# Altium project Quadcopter_v1.0.PrjPCB
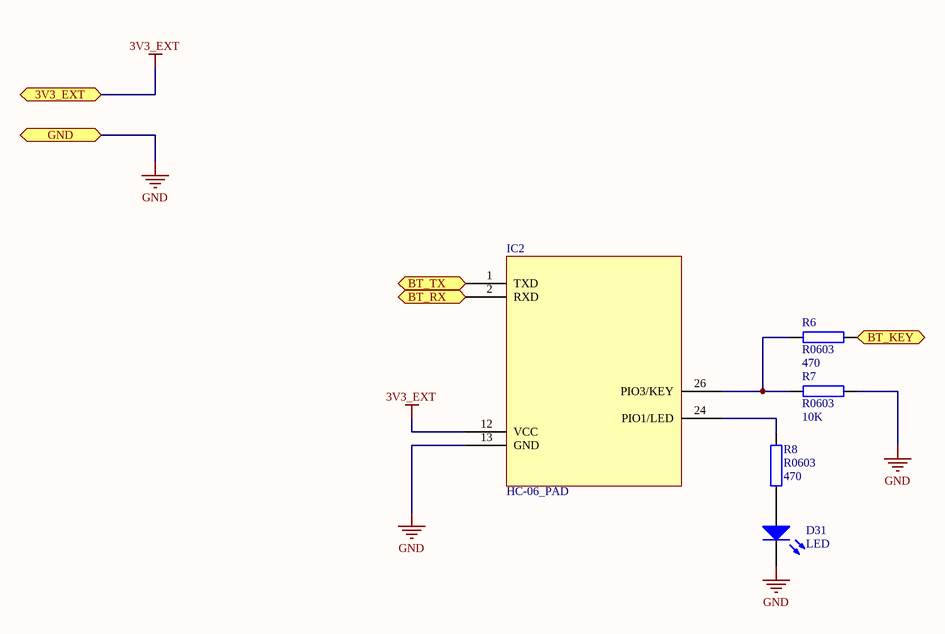
[diagram p0: BlueTooth.SchDoc]
8 sheets, 110 parts. Net scope: flat (ports and power ports of the same name join across sheets).
Board file: Quadcopter_v1.0.PcbDoc
Sheets:
  BlueTooth.SchDoc
  Quadcopter_v1.0.SchDoc
  WiFi.SchDoc
  Power.SchDoc
  MPU.SchDoc
  Motor.SchDoc
  nRF24L01.SchDoc
  STM32F103CBT6.SchDoc

## Sheet BlueTooth.SchDoc
size A

### Parts
(Parts that share a designator on the sheet are numbered #1, #2 ... from top to bottom, then left to right.)
D31  LED  [LED_0603]
IC2  HC-06_PAD  [HC-0X_PAD]
R6#1  R0603  value 470  [R0603]
R7#1  R0603  value 10K  [R0603]
R8#1  R0603  value 470  [R0603]

### Ports
3V3_EXT, BT_KEY (in), BT_RX (in), BT_TX (out), GND

### Nets
3V3_EXT: IC2.12(VCC) ; port 3V3_EXT
GND: D31.2(K) IC2.13(GND) R7#1.2 ; port GND
NetD31_1: D31.1(A) R8#1.1
NetIC2_1: IC2.1(TXD) ; port BT_TX
NetIC2_2: IC2.2(RXD) ; port BT_RX
NetIC2_24: IC2.24(PIO1/LED) R8#1.2
NetIC2_26: IC2.26(PIO3/KEY) R6#1.1 R7#1.1
NetR6#1_2: R6#1.2 ; port BT_KEY

### Library data of the parts
D31 = LED: Typical INFRARED GaAs LED; Published: 8-Jun-2000; LatestRevisionDate: 08-Jul-2005; LatestRevisionNote: Mech Layer 1 removed.; PackageReference: LED-0; Publisher: Altium Limited; PackageDescription: LED; 2 Leads
R6#1 R7#1 R8#1 = Res3: Resistor; Published: 8-Jun-2000; LatestRevisionDate: 29-May-2009; LatestRevisionNote: IPC-7351 Footprint Added.; PackageReference: R0603; Publisher: Altium Limited; PackageDescription: Chip Resistor

## Sheet Quadcopter_v1.0.SchDoc
size A3; PageSetup: Record=PageOptions|CenterHorizontal=True|CenterVertical=True|PrintScale=1.00|XCorrection=1.00|YCorrection=1.00|PrintKind=1|BorderSize=5000000|LeftOffset=0|BottomOffset=0|Orientation=2|PaperLength=1000|PaperWidth=1000|Scale=100|PaperSource=7|PrintQuality=-3|MediaType=1|DitherType=10|PrintScaleMode=1|PaperKind=A3|PaperIndex=8
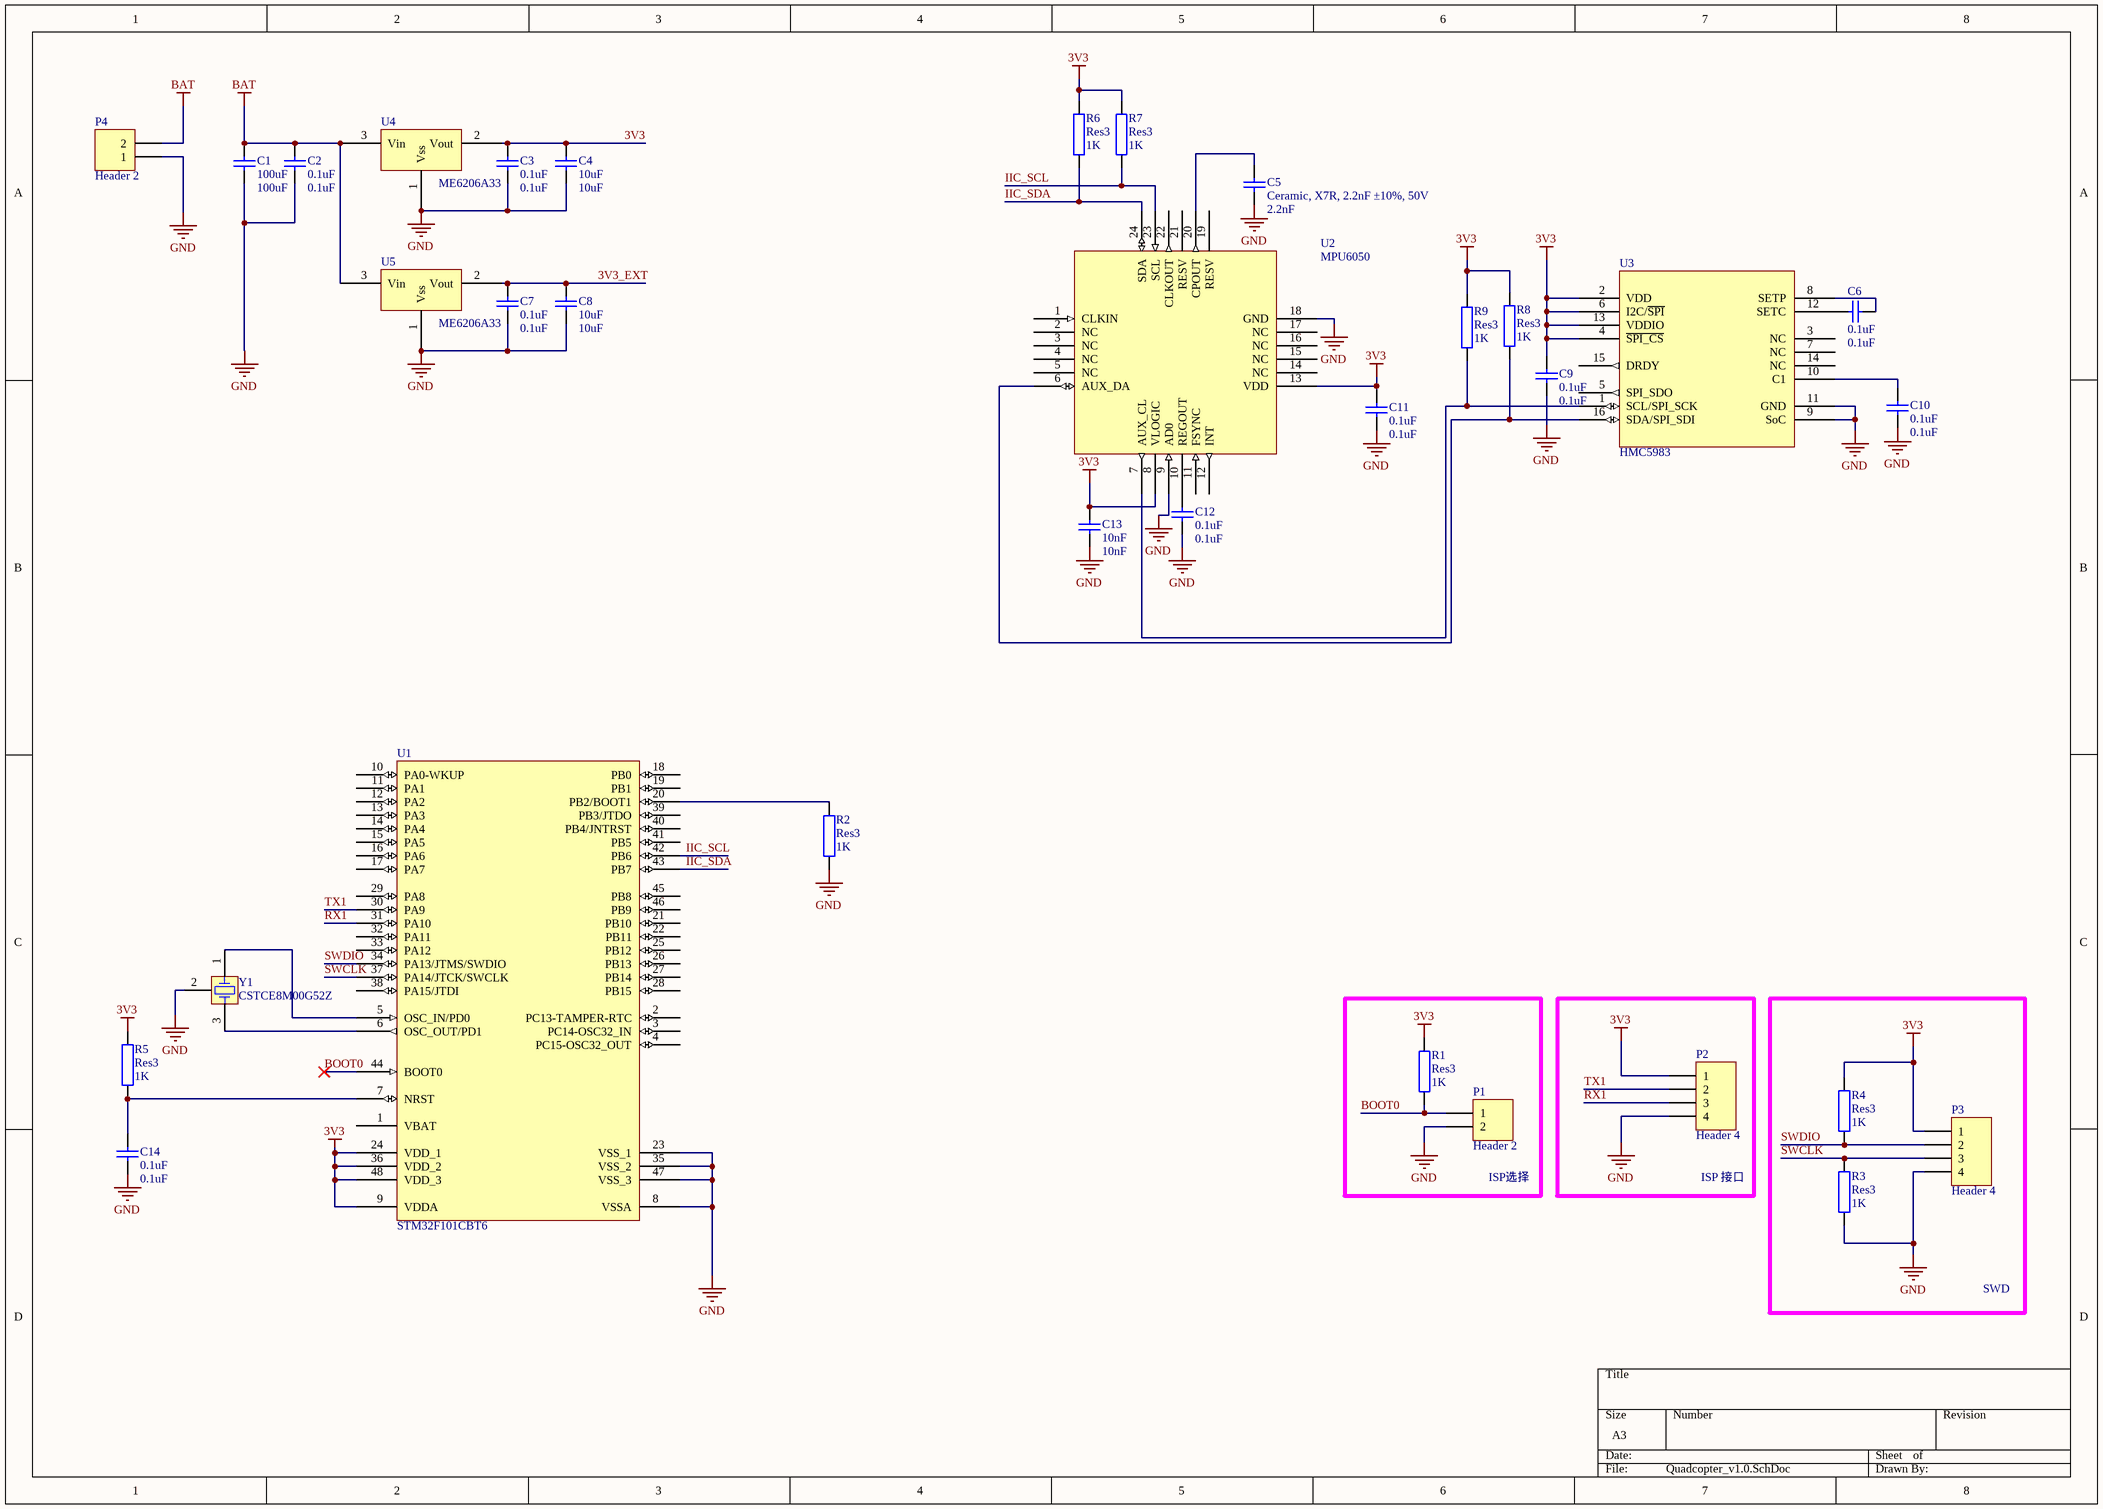
[diagram p1: Quadcopter_v1.0.SchDoc]

### Parts
(Parts that share a designator on the sheet are numbered #1, #2 ... from top to bottom, then left to right.)
C1#1  100uF  [c0805]
C2#1  0.1uF  [c0805]
C3#1  0.1uF  [c0805]
C4#1  10uF  [c0805]
C5#1  Ceramic, X7R, 2.2nF ±10%, 50V  value 2.2nF  [c0805]
C6#1  0.1uF  [c0805]
C7#1  0.1uF  [c0805]
C8#1  10uF  [c0805]
C9#1  0.1uF  [C1206]
C10#1  0.1uF  [C1206]
C11#1  0.1uF  [c0805]
C12#1  0.1uF  [c0805]
C13#1  10nF  [c0805]
C14#1  0.1uF  [C1206]
P1#1  Header 2  [HDR1X2]
P2#1  Header 4  [HDR1X4]
P3#1  Header 4  [HDR1X4]
P4  Header 2  [HDR1X2]
R1#1  Res3  value 1K  [r0603]
R2#1  Res3  value 1K  [r0603]
R3#1  Res3  value 1K  [r0603]
R4#1  Res3  value 1K  [r0603]
R5#1  Res3  value 1K  [r0603]
R6#2  Res3  value 1K  [r0603]
R7#2  Res3  value 1K  [r0603]
R8#2  Res3  value 1K  [r0603]
R9#1  Res3  value 1K  [r0603]
U1#1  STM32F101CBT6  [LQFP48_N]
U2#1  MPU6050  [24 Lead QFN]
U3#1  HMC5983  [16 Lead QFN 2]
U4#1  ME6206A33  [SOT 23]
U5#1  ME6206A33  [SOT 23]
Y1#1  CSTCE8M00G52Z  [X8MCSTCR]

### Blocks framed on the sheet
ISP选择: P1#1 R1#1
ISP 接口: P2#1
SWD: P3#1 R3#1 R4#1

### Nets
3V3: C3#1.2 C4#1.2 C9#1.2 C11#1.2 C13#1.2 P2#1.1 P3#1.1 R1#1.2 R4#1.2 R5#1.1 R6#2.2 R7#2.2 R8#2.2 R9#1.2 U1#1.9(VDDA) U1#1.24(VDD_1) U1#1.36(VDD_2) U1#1.48(VDD_3) U2#1.8(VLOGIC) U2#1.13(VDD) U3#1.2(VDD) U3#1.4(~{SPI_CS}) U3#1.6(I2C/~{SPI}) U3#1.13(VDDIO) U4#1.2(Vout)
BAT: C1#1.2 C2#1.2 P4.2 U4#1.3(Vin) U5#1.3(Vin)
GND: C1#1.1 C2#1.1 C3#1.1 C4#1.1 C5#1.1 C7#1.1 C8#1.1 C9#1.1 C10#1.1 C11#1.1 C12#1.1 C13#1.1 C14#1.1 P1#1.2 P2#1.4 P3#1.4 P4.1 R2#1.1 R3#1.1 U1#1.8(VSSA) U1#1.23(VSS_1) U1#1.35(VSS_2) U1#1.47(VSS_3) U2#1.9(AD0) U2#1.18(GND) U3#1.9(SoC) U3#1.11(GND) U4#1.1(Vss) U5#1.1(Vss) Y1#1.2(COM)
3V3_EXT: C7#1.2 C8#1.2 U5#1.2(Vout)
BOOT0: P1#1.1 R1#1.1 U1#1.44(BOOT0)
IIC_SCL: R7#2.1 U1#1.42(PB6) U2#1.23(SCL)
IIC_SDA: R6#2.1 U1#1.43(PB7) U2#1.24(SDA)
RX1: P2#1.3 U1#1.31(PA10)
SWCLK: P3#1.3 R3#1.2 U1#1.37(PA14/JTCK/SWCLK)
SWDIO: P3#1.2 R4#1.1 U1#1.34(PA13/JTMS/SWDIO)
TX1: P2#1.2 U1#1.30(PA9)
NetC5#1_2: C5#1.2 U2#1.20(CPOUT)
NetC6#1_1: C6#1.1 U3#1.8(SETP)
NetC6#1_2: C6#1.2 U3#1.12(SETC)
NetC10#1_2: C10#1.2 U3#1.10(C1)
NetC12#1_2: C12#1.2 U2#1.10(REGOUT)
NetC14#1_2: C14#1.2 R5#1.2 U1#1.7(NRST)
NetR2#1_2: R2#1.2 U1#1.20(PB2/BOOT1)
NetR8#2_1: R8#2.1 U2#1.6(AUX_DA) U3#1.16(SDA/SPI_SDI)
NetR9#1_1: R9#1.1 U2#1.7(AUX_CL) U3#1.1(SCL/SPI_SCK)
NetU1#1_5: U1#1.5(OSC_IN/PD0) Y1#1.1(OSC1)
NetU1#1_6: U1#1.6(OSC_OUT/PD1) Y1#1.3(OSC2)

Not connected (* = marked no-connect by the designer): U1#1 1(VBAT) 2(PC13-TAMPER-RTC) 3(PC14-OSC32_IN) 4(PC15-OSC32_OUT) 10(PA0-WKUP) 11(PA1) 12(PA2) 13(PA3) 14(PA4) 15(PA5) 16(PA6) 17(PA7) 18(PB0) 19(PB1) 21(PB10) 22(PB11) 25(PB12) 26(PB13) 27(PB14) 28(PB15) 29(PA8) 32(PA11) 33(PA12) 38(PA15/JTDI) 39(PB3/JTDO) 40(PB4/JNTRST) 41(PB5) 45(PB8) 46(PB9); U2#1 1(CLKIN) 2(NC) 3(NC) 4(NC) 5(NC) 11(FSYNC) 12(INT) 14(NC) 15(NC) 16(NC) 17(NC) 19(RESV) 21(RESV) 22(CLKOUT); U3#1 3(NC) 5(SPI_SDO) 7(NC) 14(NC) 15(DRDY)

### Library data of the parts
C1#1 C2#1 C3#1 C4#1 C5#1 C7#1 C8#1 C11#1 C12#1 C13#1 = Cap Semi: Capacitor (Semiconductor SIM Model); Published: 8-Jun-2000; LatestRevisionDate: 29-May-2009; LatestRevisionNote: IPC-7351 Footprint Added.; PackageReference: C1206; Publisher: Altium Limited; PackageDescription: Chip Capacitor
  C1#1: Value: 100uF
  C2#1 C3#1 C7#1 C11#1 C12#1: Value: 0.1uF
  C4#1 C8#1: Value: 10uF
  C13#1: Value: 10nF
C6#1 C9#1 C10#1 C14#1 = Cap: Capacitor (Semiconductor SIM Model); Published: 8-Jun-2000; LatestRevisionDate: 29-May-2009; LatestRevisionNote: IPC-7351 Footprint Added.; PackageReference: C1206; Publisher: Altium Limited; PackageDescription: Chip Capacitor; Value: 0.1uF
P1#1 P4 = Header 2: Header, 2-Pin; LatestRevisionDate: 17-Jul-2002; LatestRevisionNote: Re-released for DXP Platform.; Publisher: Altium Limited
P2#1 P3#1 = Header 4: Header, 4-Pin; LatestRevisionDate: 17-Jul-2002; LatestRevisionNote: Re-released for DXP Platform.; Publisher: Altium Limited
R1#1 R2#1 R3#1 R4#1 R5#1 R6#2 R7#2 R8#2 R9#1 = Res3: Resistor; Published: 8-Jun-2000; LatestRevisionDate: 29-May-2009; LatestRevisionNote: IPC-7351 Footprint Added.; PackageReference: J1-0603; Publisher: Altium Limited; PackageDescription: Chip Resistor
U1#1 = STM32F101CBT6: STM32 ARM-based 32-bit MCU with 128 Kbytes Flash, 48-pin LQFP, Industrial Temperature; Published: 30-May-2008; DatasheetVersion: rev6, Mar-2008; PackageVersion: Mar-2008; PackageReference: LQFP48; Publisher: Altium Limited; PackageDescription: 48-Pin Low-Profile Quad Flat Pack, 7 x 7 mm Body, 0.5 mm Pitch (LQFP48); ComponentLink1Description: Manufacturer Link; ComponentLink1URL: www.st.com/stm32; ComponentLink2Description: Datasheet; ComponentLink2URL: http://www.st.com/stonline/products/literature/ds/13586.pdf
U2#1 = MPU6050: MPU6050, 24pin
U3#1 = HMC5983: HMC5983, 16pin
U4#1 U5#1 = ME6206: ME6206A33, SOT23
Y1#1 = CSTCE8M00G52Z: Crystal Oscillator, 3rd In-Line Lead Version

## Sheet WiFi.SchDoc
size A; PageSetup: Record=PageOptions|CenterHorizontal=True|CenterVertical=True|PrintScale=1.00|XCorrection=1.00|YCorrection=1.00|PrintKind=1|BorderSize=5000000|LeftOffset=0|BottomOffset=0|Orientation=2|PaperLength=1000|PaperWidth=1000|Scale=100|PaperSource=7|PrintQuality=-3|MediaType=1|DitherType=10|PrintScaleMode=1|PaperKind=Letter|PaperIndex=1
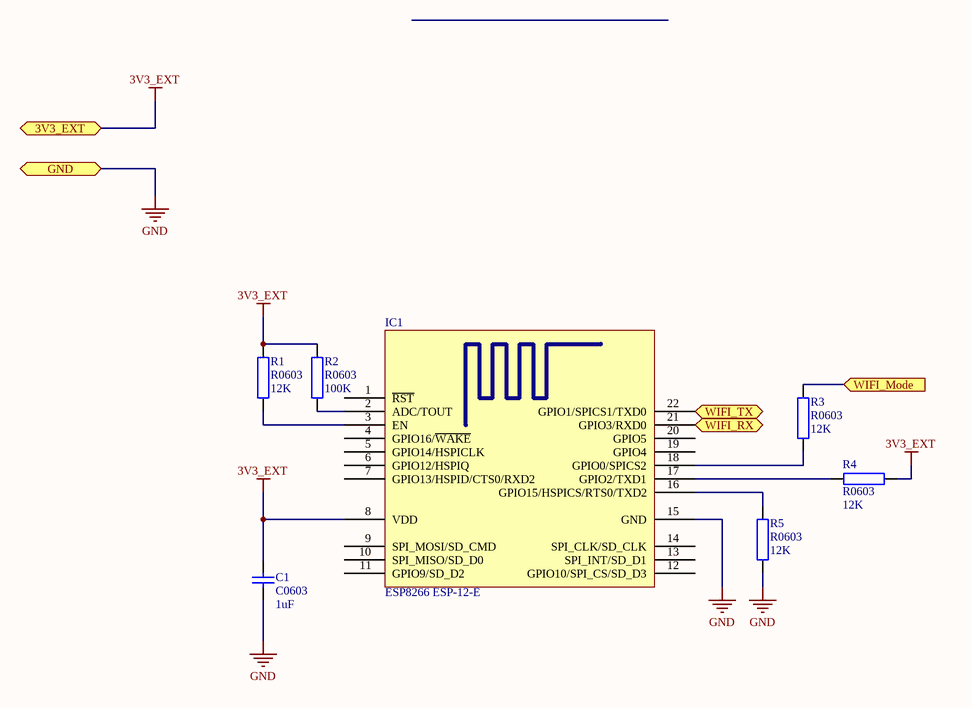
[diagram p2: WiFi.SchDoc]

### Parts
(Parts that share a designator on the sheet are numbered #1, #2 ... from top to bottom, then left to right.)
C1#2  C0603  value 1uF  [C0603]  (no BOM)
IC1  ESP8266 ESP-12-E  [ESP_12_E]
R1#2  R0603  value 12K  [R0603]
R2#2  R0603  value 100K  [R0603]
R3#2  R0603  value 12K  [R0603]
R4#2  R0603  value 12K  [R0603]
R5#2  R0603  value 12K  [R0603]

### Ports
3V3_EXT, GND, WIFI_Mode (in), WIFI_RX (in), WIFI_TX (out)

### Nets
3V3_EXT: C1#2.2 IC1.8(VDD) R1#2.2 R2#2.2 R4#2.1 ; port 3V3_EXT
GND: C1#2.1 IC1.15(GND) R5#2.2 ; port GND
NetIC1_2: IC1.2(ADC/TOUT) R2#2.1
NetIC1_3: IC1.3(EN) R1#2.1
NetIC1_16: IC1.16(GPIO15/HSPICS/RTS0/TXD2) R5#2.1
NetIC1_17: IC1.17(GPIO2/TXD1) R4#2.2
NetIC1_18: IC1.18(GPIO0/SPICS2) R3#2.2
NetIC1_21: IC1.21(GPIO3/RXD0) ; port WIFI_RX
NetIC1_22: IC1.22(GPIO1/SPICS1/TXD0) ; port WIFI_TX
NetR3#2_1: R3#2.1 ; port WIFI_Mode

Not connected (* = marked no-connect by the designer): IC1 1(~{RST}) 4(GPIO16/~{WAKE}) 5(GPIO14/HSPICLK) 6(GPIO12/HSPIQ) 7(GPIO13/HSPID/CTS0/RXD2) 9(SPI_MOSI/SD_CMD) 10(SPI_MISO/SD_D0) 11(GPIO9/SD_D2) 12(GPIO10/SPI_CS/SD_D3) 13(SPI_INT/SD_D1) 14(SPI_CLK/SD_CLK) 19(GPIO4) 20(GPIO5)

### Library data of the parts
C1#2 = Cap: Capacitor (Semiconductor SIM Model); Published: 8-Jun-2000; LatestRevisionDate: 29-May-2009; LatestRevisionNote: IPC-7351 Footprint Added.; PackageReference: C0603; Publisher: Altium Limited; PackageDescription: Chip Capacitor
R1#2 R2#2 R3#2 R4#2 R5#2 = Res3: Resistor; Published: 8-Jun-2000; LatestRevisionDate: 29-May-2009; LatestRevisionNote: IPC-7351 Footprint Added.; PackageReference: R0603; Publisher: Altium Limited; PackageDescription: Chip Resistor

## Sheet Power.SchDoc
size A
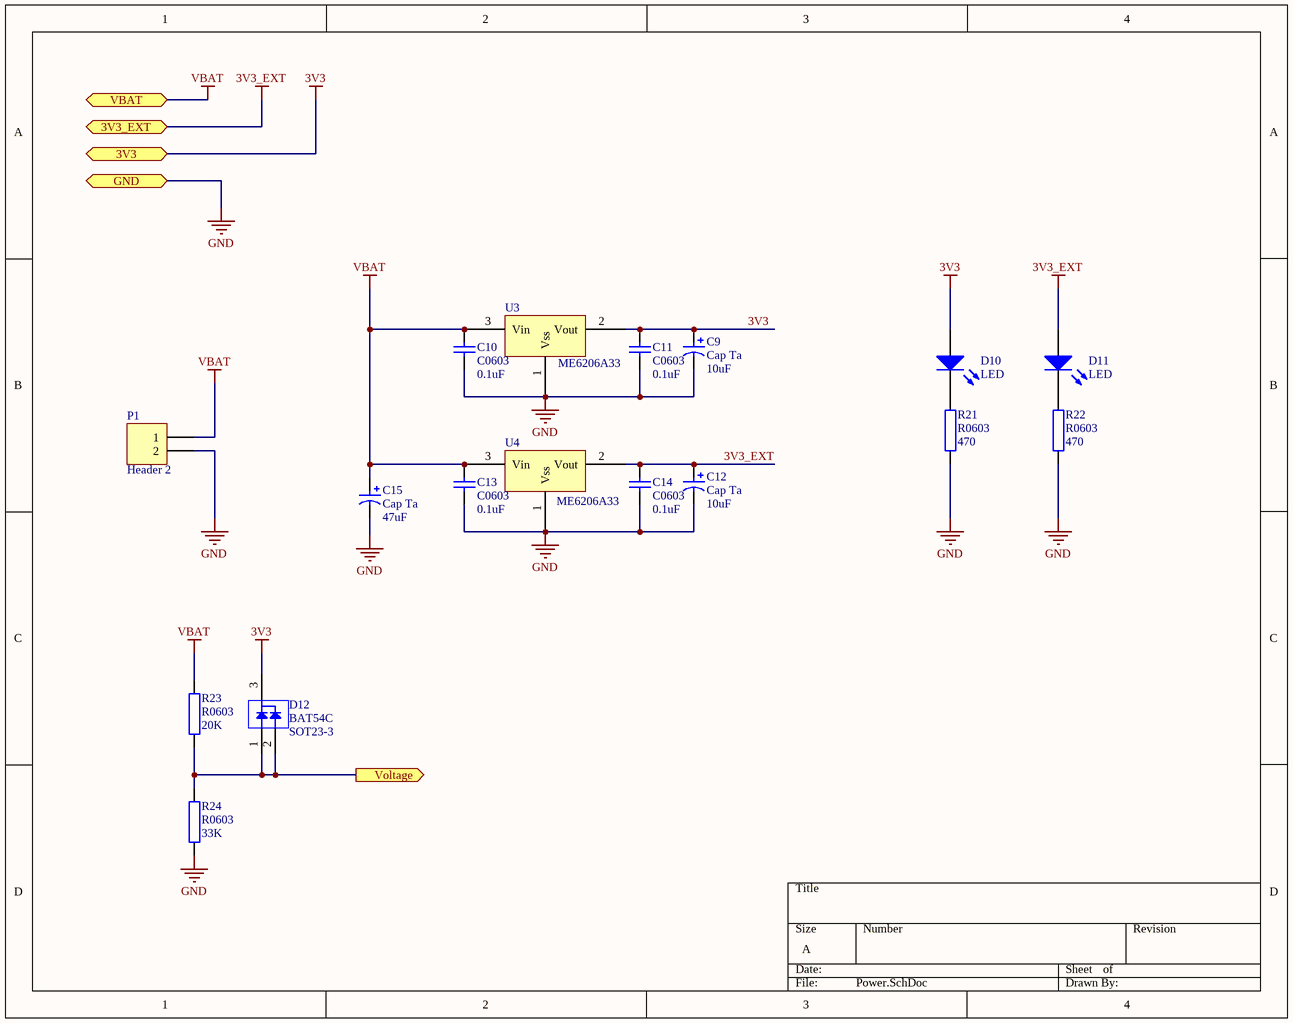
[diagram p3: Power.SchDoc]

### Parts
(Parts that share a designator on the sheet are numbered #1, #2 ... from top to bottom, then left to right.)
C9#2  Cap Ta  value 10uF  [Cap_Ta_A_Case]
C10#2  C0603  value 0.1uF  [C0603]  (no BOM)
C11#2  C0603  value 0.1uF  [C0603]  (no BOM)
C12#2  Cap Ta  value 10uF  [Cap_Ta_A_Case]
C13#2  C0603  value 0.1uF  [C0603]  (no BOM)
C14#2  C0603  value 0.1uF  [C0603]  (no BOM)
C15  Cap Ta  value 47uF  [Cap_Ta_B_Case]
D10  LED  [LED_0603]
D11  LED  [LED_0603]
D12  BAT54C  [SOT23-3]
P1#2  Header 2  [HDR1X2]
R21  R0603  value 470  [R0603]
R22  R0603  value 470  [R0603]
R23  R0603  value 20K  [r0603]
R24  R0603  value 33K  [r0603]
U3#2  ME6206A33  [SOT23-3]
U4#2  ME6206A33  [SOT23-3]

### Ports
3V3, 3V3_EXT, GND, VBAT, Voltage (out)

### Nets
3V3: C9#2.1 C11#2.1 D10.1(A) D12.3 U3#2.2(Vout) ; port 3V3
3V3_EXT: C12#2.1 C14#2.1 D11.1(A) U4#2.2(Vout) ; port 3V3_EXT
GND: C9#2.2 C10#2.2 C11#2.2 C12#2.2 C13#2.2 C14#2.2 C15.2 P1#2.2 R21.1 R22.1 R24.1 U3#2.1(Vss) U4#2.1(Vss) ; port GND
VBAT: C10#2.1 C13#2.1 C15.1 P1#2.1 R23.2 U3#2.3(Vin) U4#2.3(Vin) ; port VBAT
NetD10_2: D10.2(K) R21.2
NetD11_2: D11.2(K) R22.2
NetD12_1: D12.1 D12.2 R23.1 R24.2 ; port Voltage

### Library data of the parts
C9#2 C12#2 C15 = Cap Tantalum: Polarized Capacitor (Surface Mount); Published: 8-Jun-2000; LatestRevisionDate: 29-May-2009; LatestRevisionNote: IPC-7351 Footprint Added.; PackageReference: Cap_Ta_A_Case; Publisher: Altium Limited; PackageDescription: Chip Capacitor
C10#2 C11#2 C13#2 C14#2 = Cap: Capacitor (Semiconductor SIM Model); Published: 8-Jun-2000; LatestRevisionDate: 29-May-2009; LatestRevisionNote: IPC-7351 Footprint Added.; PackageReference: C0603; Publisher: Altium Limited; PackageDescription: Chip Capacitor
D10 D11 = LED: Typical INFRARED GaAs LED; Published: 8-Jun-2000; LatestRevisionDate: 08-Jul-2005; LatestRevisionNote: Mech Layer 1 removed.; PackageReference: LED-0; Publisher: Altium Limited; PackageDescription: LED; 2 Leads
P1#2 = Header 2: Header, 2-Pin; LatestRevisionDate: 17-Jul-2002; LatestRevisionNote: Re-released for DXP Platform.; Publisher: Altium Limited
R21-R24 = Res3: Resistor; Published: 8-Jun-2000; LatestRevisionDate: 29-May-2009; LatestRevisionNote: IPC-7351 Footprint Added.; PackageReference: R0603; Publisher: Altium Limited; PackageDescription: Chip Resistor
U3#2 U4#2 = ME6206: ME6206A33, SOT23

## Sheet MPU.SchDoc
size A
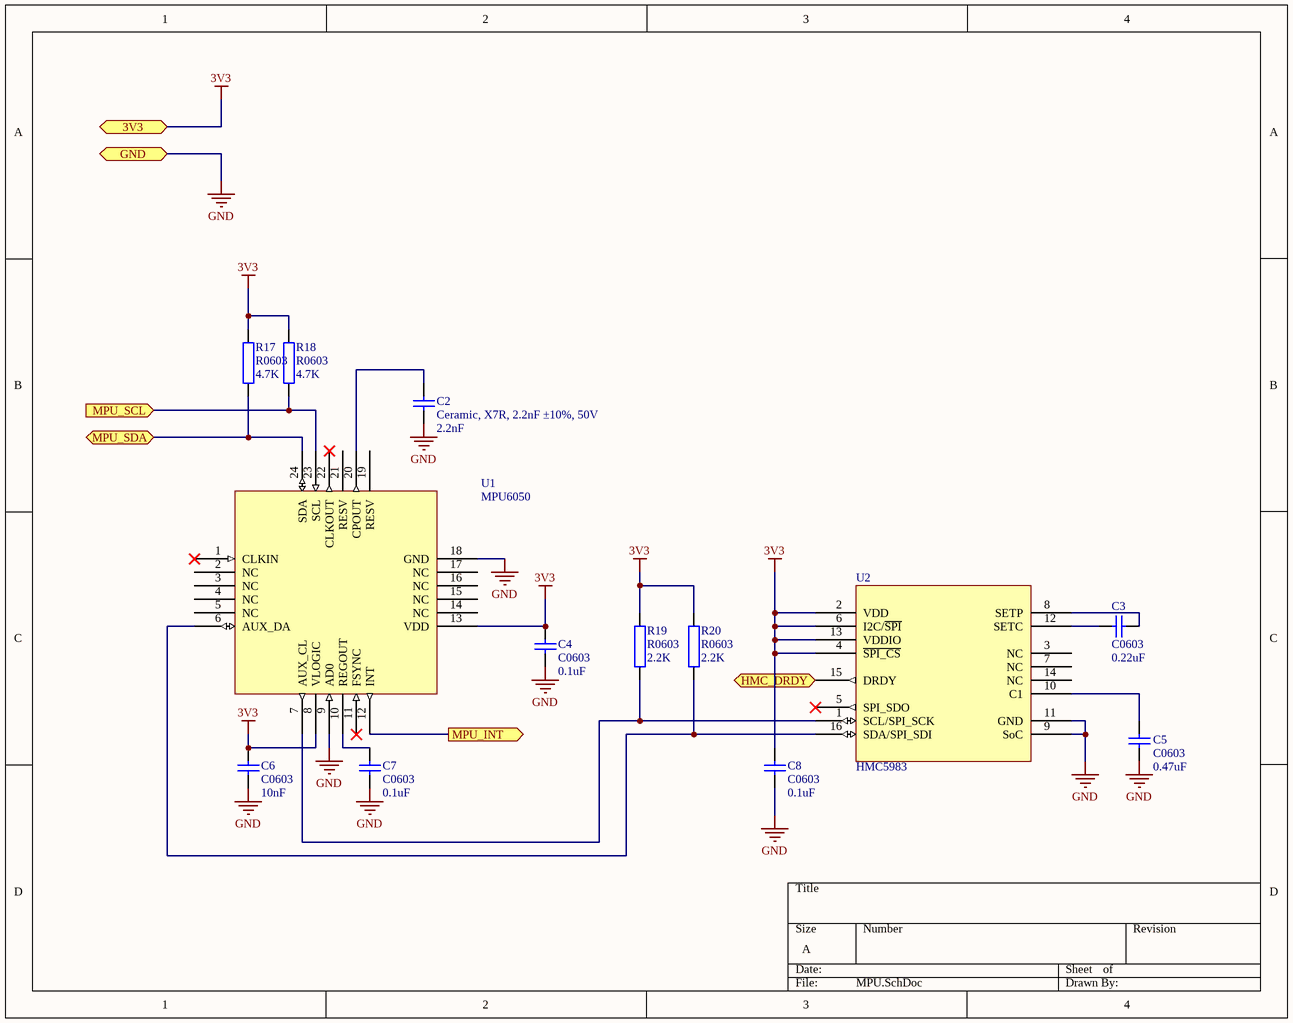
[diagram p4: MPU.SchDoc]

### Parts
(Parts that share a designator on the sheet are numbered #1, #2 ... from top to bottom, then left to right.)
C2#2  Ceramic, X7R, 2.2nF ±10%, 50V  value 2.2nF  [C0603]  (no BOM)
C3#2  C0603  value 0.22uF  [C0603]  (no BOM)
C4#2  C0603  value 0.1uF  [C0603]
C5#2  C0603  value 0.47uF  [C0603]  (no BOM)
C6#2  C0603  value 10nF  [C0603]  (no BOM)
C7#2  C0603  value 0.1uF  [C0603]  (no BOM)
C8#2  C0603  value 0.1uF  [C0603]  (no BOM)
R17  R0603  value 4.7K  [R0603]
R18  R0603  value 4.7K  [R0603]
R19  R0603  value 2.2K  [R0603]
R20  R0603  value 2.2K  [R0603]
U1#2  MPU6050  [24 Lead QFN]
U2#2  HMC5983  [16 Lead QFN 2]

### Ports
3V3, GND, HMC_DRDY (out), MPU_INT (out), MPU_SCL (in), MPU_SDA (bidir)

### Nets
3V3: C4#2.2 C6#2.2 C8#2.2 R17.2 R18.2 R19.2 R20.2 U1#2.8(VLOGIC) U1#2.13(VDD) U2#2.2(VDD) U2#2.4(~{SPI_CS}) U2#2.6(I2C/~{SPI}) U2#2.13(VDDIO) ; port 3V3
GND: C2#2.1 C4#2.1 C5#2.1 C6#2.1 C7#2.1 C8#2.1 U1#2.9(AD0) U1#2.18(GND) U2#2.9(SoC) U2#2.11(GND) ; port GND
NetC2#2_2: C2#2.2 U1#2.20(CPOUT)
NetC3#2_1: C3#2.1 U2#2.8(SETP)
NetC3#2_2: C3#2.2 U2#2.12(SETC)
NetC5#2_2: C5#2.2 U2#2.10(C1)
NetC7#2_2: C7#2.2 U1#2.10(REGOUT)
NetR17_1: R17.1 U1#2.24(SDA) ; port MPU_SDA
NetR18_1: R18.1 U1#2.23(SCL) ; port MPU_SCL
NetR19_1: R19.1 U1#2.7(AUX_CL) U2#2.1(SCL/SPI_SCK)
NetR20_1: R20.1 U1#2.6(AUX_DA) U2#2.16(SDA/SPI_SDI)
NetU1#2_12: U1#2.12(INT) ; port MPU_INT
NetU2#2_15: U2#2.15(DRDY) ; port HMC_DRDY

Not connected (* = marked no-connect by the designer): U1#2 1(CLKIN)* 2(NC) 3(NC) 4(NC) 5(NC) 11(FSYNC)* 14(NC) 15(NC) 16(NC) 17(NC) 19(RESV) 21(RESV) 22(CLKOUT)*; U2#2 3(NC) 5(SPI_SDO)* 7(NC) 14(NC)

### Library data of the parts
C2#2 C3#2 C4#2 C5#2 C6#2 C7#2 C8#2 = Cap: Capacitor (Semiconductor SIM Model); Published: 8-Jun-2000; LatestRevisionDate: 29-May-2009; LatestRevisionNote: IPC-7351 Footprint Added.; PackageReference: C0603; Publisher: Altium Limited; PackageDescription: Chip Capacitor
R17-R20 = Res3: Resistor; Published: 8-Jun-2000; LatestRevisionDate: 29-May-2009; LatestRevisionNote: IPC-7351 Footprint Added.; PackageReference: R0603; Publisher: Altium Limited; PackageDescription: Chip Resistor
U1#2 = MPU6050: MPU6050, 24pin
U2#2 = HMC5983: HMC5983, 16pin

## Sheet Motor.SchDoc
size A
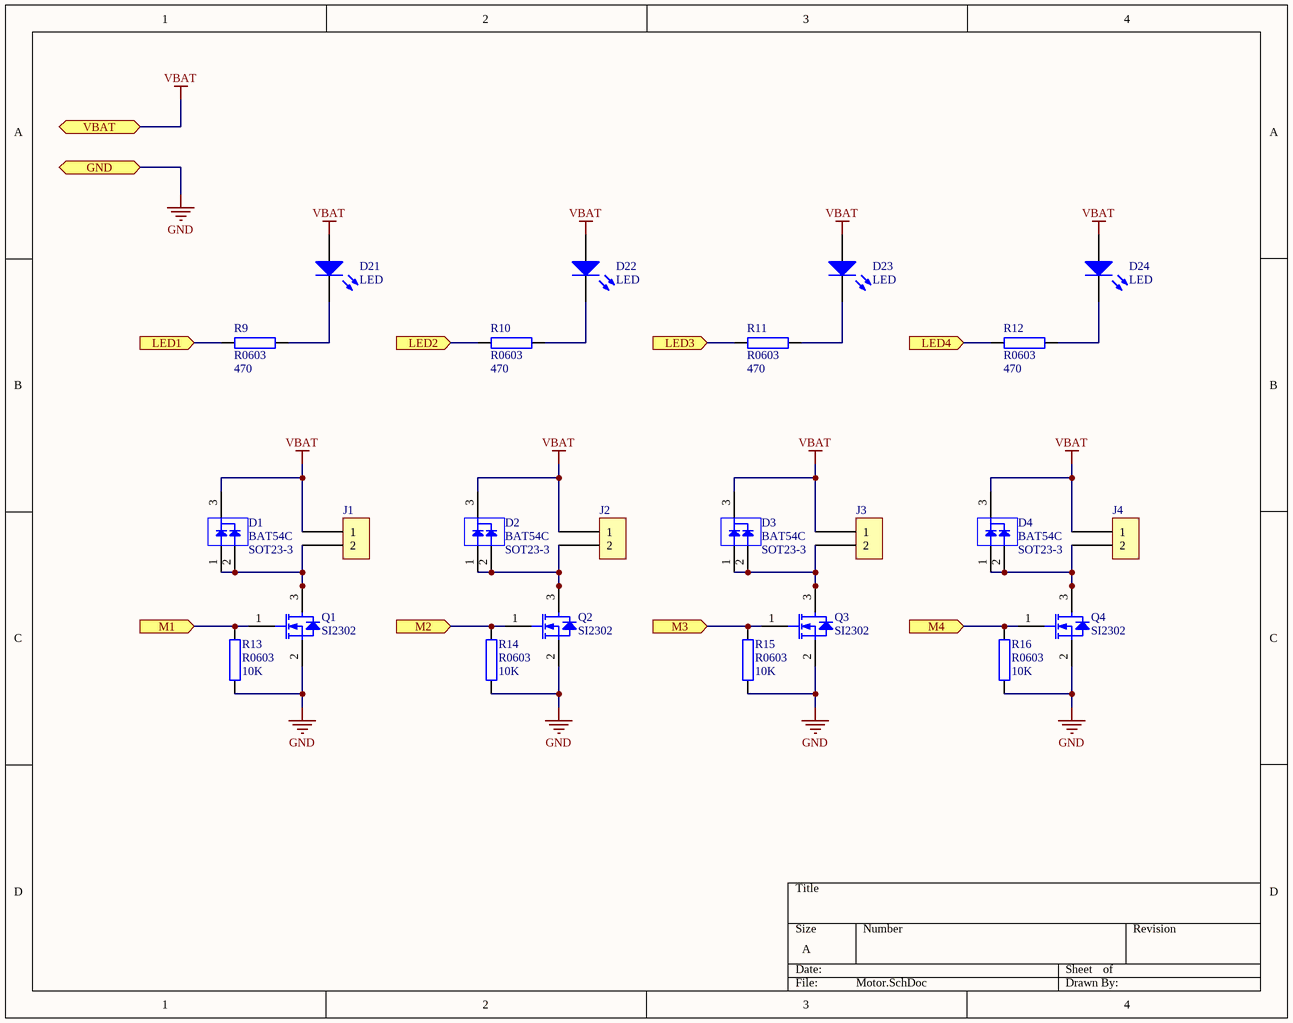
[diagram p5: Motor.SchDoc]

### Parts
(Parts that share a designator on the sheet are numbered #1, #2 ... from top to bottom, then left to right.)
D1  BAT54C  [SOT23-3]
D2  BAT54C  [SOT23-3]
D3  BAT54C  [SOT23-3]
D4  BAT54C  [SOT23-3]
D21  LED  [LED_0603]
D22  LED  [LED_0603]
D23  LED  [LED_0603]
D24  LED  [LED_0603]
J1  motor bonding pad  [Motor_Pin_Pad]  (value not drawn)
J2  motor bonding pad  [Motor_Pin_Pad]  (value not drawn)
J3  motor bonding pad  [Motor_Pin_Pad]  (value not drawn)
J4  motor bonding pad  [Motor_Pin_Pad]  (value not drawn)
Q1  SI2302  [SOT23-3]
Q2  SI2302  [SOT23-3]
Q3  SI2302  [SOT23-3]
Q4  SI2302  [SOT23-3]
R9#2  R0603  value 470  [R0603]
R10  R0603  value 470  [R0603]
R11  R0603  value 470  [R0603]
R12  R0603  value 470  [R0603]
R13  R0603  value 10K  [R0603]
R14  R0603  value 10K  [R0603]
R15  R0603  value 10K  [R0603]
R16  R0603  value 10K  [R0603]

### Ports
GND, LED1 (in), LED2 (in), LED3 (in), LED4 (in), M1 (in), M2 (in), M3 (in), M4 (in), VBAT

### Nets
GND: Q1.2(S) Q2.2(S) Q3.2(S) Q4.2(S) R13.1 R14.1 R15.1 R16.1 ; port GND
VBAT: D1.3 D2.3 D3.3 D4.3 D21.1(A) D22.1(A) D23.1(A) D24.1(A) J1.1 J2.1 J3.1 J4.1 ; port VBAT
NetD1_1: D1.1 D1.2 J1.2 Q1.3(D)
NetD2_1: D2.1 D2.2 J2.2 Q2.3(D)
NetD3_1: D3.1 D3.2 J3.2 Q3.3(D)
NetD4_1: D4.1 D4.2 J4.2 Q4.3(D)
NetD21_2: D21.2(K) R9#2.2
NetD22_2: D22.2(K) R10.2
NetD23_2: D23.2(K) R11.2
NetD24_2: D24.2(K) R12.2
NetQ1_1: Q1.1(G) R13.2 ; port M1
NetQ2_1: Q2.1(G) R14.2 ; port M2
NetQ3_1: Q3.1(G) R15.2 ; port M3
NetQ4_1: Q4.1(G) R16.2 ; port M4
NetR9#2_1: R9#2.1 ; port LED1
NetR10_1: R10.1 ; port LED2
NetR11_1: R11.1 ; port LED3
NetR12_1: R12.1 ; port LED4

### Library data of the parts
D21-D24 = LED: Typical INFRARED GaAs LED; Published: 8-Jun-2000; LatestRevisionDate: 08-Jul-2005; LatestRevisionNote: Mech Layer 1 removed.; PackageReference: LED-0; Publisher: Altium Limited; PackageDescription: LED; 2 Leads
J1-J4 = Joint_Motor
Q1-Q4 = SI2302: N-Channel MOSFET; Published: 8-Jun-2000; LatestRevisionDate: 17-Jul-2002; LatestRevisionNote: Re-released for DXP Platform.; PackageVersion: 1995/1996; PackageReference: SOT23-3; Publisher: Altium Limited; PackageDescription: TO, Flat Index; 3 In-Line, Axial Leads; Body Dia. 4.6mm; Lead Dia. 0.5 mm (max)
R9#2 R10-R16 = Res3: Resistor; Published: 8-Jun-2000; LatestRevisionDate: 29-May-2009; LatestRevisionNote: IPC-7351 Footprint Added.; PackageReference: R0603; Publisher: Altium Limited; PackageDescription: Chip Resistor

## Sheet nRF24L01.SchDoc
size A
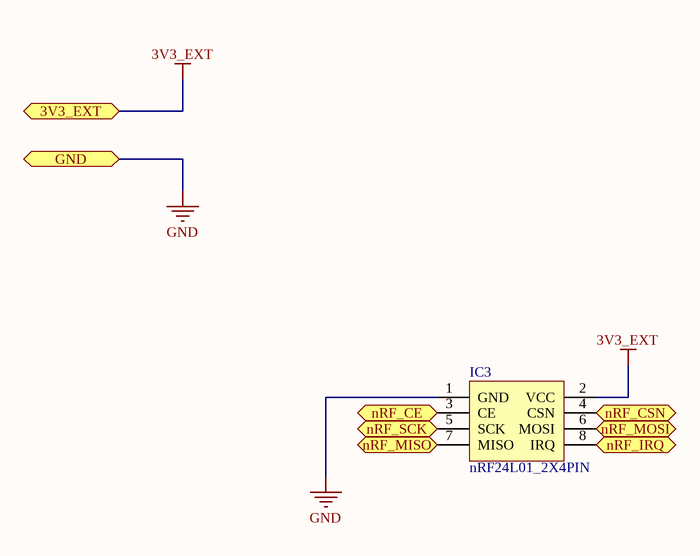
[diagram p6: nRF24L01.SchDoc]

### Parts
IC3  nRF24L01_2X4PIN  [nRF24L01_module]

### Ports
3V3_EXT, GND, nRF_CE (in), nRF_CSN (in), nRF_IRQ (out), nRF_MISO (out), nRF_MOSI (in), nRF_SCK (in)

### Nets
3V3_EXT: IC3.2(VCC) ; port 3V3_EXT
GND: IC3.1(GND) ; port GND
NetIC3_3: IC3.3(CE) ; port nRF_CE
NetIC3_4: IC3.4(CSN) ; port nRF_CSN
NetIC3_5: IC3.5(SCK) ; port nRF_SCK
NetIC3_6: IC3.6(MOSI) ; port nRF_MOSI
NetIC3_7: IC3.7(MISO) ; port nRF_MISO
NetIC3_8: IC3.8(IRQ) ; port nRF_IRQ

### Library data of the parts
IC3 = nRF24L01_MOD_2X4

## Sheet STM32F103CBT6.SchDoc
size A
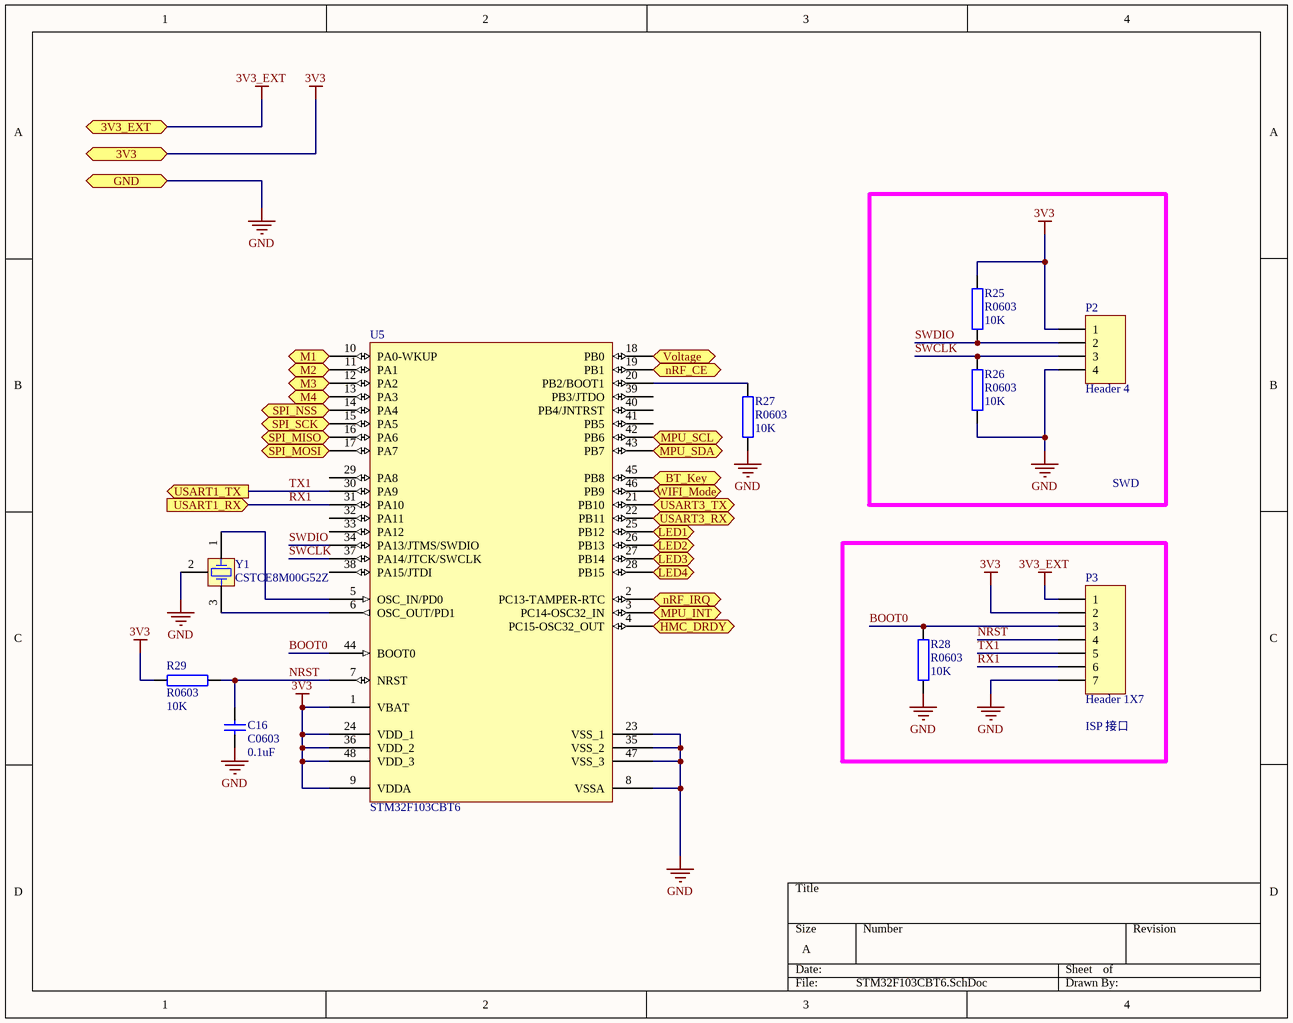
[diagram p7: STM32F103CBT6.SchDoc]

### Parts
(Parts that share a designator on the sheet are numbered #1, #2 ... from top to bottom, then left to right.)
C16  C0603  value 0.1uF  [C0603]  (no BOM)
P2#2  Header 4  [HDR1X4]
P3#2  Header 1X7  [HDR1X7]
R25  R0603  value 10K  [R0603]
R26  R0603  value 10K  [R0603]
R27  R0603  value 10K  [R0603]
R28  R0603  value 10K  [R0603]
R29  R0603  value 10K  [R0603]
U5#2  STM32F103CBT6  [LQFP48_N]
Y1#2  CSTCE8M00G52Z  [X8MCSTCR]

### Blocks framed on the sheet
SWD: P2#2 R25 R26
ISP 接口: P3#2 R28

### Ports
3V3, 3V3_EXT, BT_Key (out), GND, HMC_DRDY (in), LED1 (out), LED2 (out), LED3 (out), LED4 (out), M1 (out), M2 (out), M3 (out), M4 (out), MPU_INT (in), MPU_SCL (out), MPU_SDA (bidir), nRF_CE (out), nRF_IRQ (in), SPI_MISO (in), SPI_MOSI (out), SPI_NSS (bidir), SPI_SCK (out), USART1_RX (in), USART1_TX (out), USART3_RX (in), USART3_TX (out), Voltage (in), WIFI_Mode (out)

### Nets
3V3: P2#2.1 P3#2.2 R25.2 R29.1 U5#2.1(VBAT) U5#2.9(VDDA) U5#2.24(VDD_1) U5#2.36(VDD_2) U5#2.48(VDD_3) ; port 3V3
3V3_EXT: P3#2.1 ; port 3V3_EXT
GND: C16.1 P2#2.4 P3#2.7 R26.1 R27.1 R28.2 U5#2.8(VSSA) U5#2.23(VSS_1) U5#2.35(VSS_2) U5#2.47(VSS_3) Y1#2.2(COM) ; port GND
BOOT0: P3#2.3 R28.1 U5#2.44(BOOT0)
NRST: C16.2 P3#2.4 R29.2 U5#2.7(NRST)
RX1: P3#2.6 U5#2.31(PA10) ; port USART1_RX
SWCLK: P2#2.3 R26.2 U5#2.37(PA14/JTCK/SWCLK)
SWDIO: P2#2.2 R25.1 U5#2.34(PA13/JTMS/SWDIO)
TX1: P3#2.5 U5#2.30(PA9) ; port USART1_TX
NetD12_1: U5#2.18(PB0) ; port Voltage
NetIC3_3: U5#2.19(PB1) ; port nRF_CE
NetIC3_8: U5#2.2(PC13-TAMPER-RTC) ; port nRF_IRQ
NetQ1_1: U5#2.10(PA0-WKUP) ; port M1
NetQ2_1: U5#2.11(PA1) ; port M2
NetQ3_1: U5#2.12(PA2) ; port M3
NetQ4_1: U5#2.13(PA3) ; port M4
NetR3#2_1: U5#2.46(PB9) ; port WIFI_Mode
NetR6#1_2: U5#2.45(PB8) ; port BT_Key
NetR9#2_1: U5#2.25(PB12) ; port LED1
NetR10_1: U5#2.26(PB13) ; port LED2
NetR11_1: U5#2.27(PB14) ; port LED3
NetR12_1: U5#2.28(PB15) ; port LED4
NetR17_1: U5#2.43(PB7) ; port MPU_SDA
NetR18_1: U5#2.42(PB6) ; port MPU_SCL
NetR27_2: R27.2 U5#2.20(PB2/BOOT1)
NetU1#2_12: U5#2.3(PC14-OSC32_IN) ; port MPU_INT
NetU2#2_15: U5#2.4(PC15-OSC32_OUT) ; port HMC_DRDY
NetU5#2_5: U5#2.5(OSC_IN/PD0) Y1#2.1(OSC1)
NetU5#2_6: U5#2.6(OSC_OUT/PD1) Y1#2.3(OSC2)
NetU5#2_14: U5#2.14(PA4) ; port SPI_NSS
NetU5#2_15: U5#2.15(PA5) ; port SPI_SCK
NetU5#2_16: U5#2.16(PA6) ; port SPI_MISO
NetU5#2_17: U5#2.17(PA7) ; port SPI_MOSI
NetU5#2_21: U5#2.21(PB10) ; port USART3_TX
NetU5#2_22: U5#2.22(PB11) ; port USART3_RX

Not connected (* = marked no-connect by the designer): U5#2 29(PA8) 32(PA11) 33(PA12) 38(PA15/JTDI) 39(PB3/JTDO) 40(PB4/JNTRST) 41(PB5)

### Library data of the parts
C16 = Cap: Capacitor (Semiconductor SIM Model); Published: 8-Jun-2000; LatestRevisionDate: 29-May-2009; LatestRevisionNote: IPC-7351 Footprint Added.; PackageReference: C0603; Publisher: Altium Limited; PackageDescription: Chip Capacitor
P2#2 = Header 4: Header, 4-Pin; LatestRevisionDate: 17-Jul-2002; LatestRevisionNote: Re-released for DXP Platform.; Publisher: Altium Limited
P3#2 = Header 1X7: Header, 7-Pin; LatestRevisionDate: 17-Jul-2002; LatestRevisionNote: Re-released for DXP Platform.; Publisher: Altium Limited
R25-R29 = Res3: Resistor; Published: 8-Jun-2000; LatestRevisionDate: 29-May-2009; LatestRevisionNote: IPC-7351 Footprint Added.; PackageReference: R0603; Publisher: Altium Limited; PackageDescription: Chip Resistor
U5#2 = STM32F103CBT6: STM32 ARM-based 32-bit MCU with 128 Kbytes Flash, 48-pin LQFP, Industrial Temperature; Published: 30-May-2008; DatasheetVersion: rev6, Mar-2008; PackageVersion: Mar-2008; PackageReference: LQFP48; Publisher: Altium Limited; PackageDescription: 48-Pin Low-Profile Quad Flat Pack, 7 x 7 mm Body, 0.5 mm Pitch (LQFP48); ComponentLink1Description: Manufacturer Link; ComponentLink1URL: www.st.com/stm32; ComponentLink2Description: Datasheet; ComponentLink2URL: http://www.st.com/stonline/products/literature/ds/13587.pdf
Y1#2 = CSTCE8M00G52Z: as Y1#1 on sheet Quadcopter_v1.0

## Nets that join several sheets
3V3: Quadcopter_v1.0 (25 pins), Power (5 pins), MPU (13 pins), STM32F103CBT6 (9 pins)
3V3_EXT: BlueTooth (IC2.12), WiFi (5 pins), Power (C12#2.1 C14#2.1 D11.1 U4#2.2), nRF24L01 (IC3.2), STM32F103CBT6 (P3#2.1)
GND: BlueTooth (D31.2 IC2.13 R7#1.2), Quadcopter_v1.0 (30 pins), WiFi (C1#2.1 IC1.15 R5#2.2), Power (13 pins), MPU (10 pins), Motor (8 pins), nRF24L01 (IC3.1), STM32F103CBT6 (11 pins)
VBAT: Power (7 pins), Motor (12 pins)
NetD12_1: Power (D12.1 D12.2 R23.1 R24.2), STM32F103CBT6 (U5#2.18)
NetIC3_3: nRF24L01 (IC3.3), STM32F103CBT6 (U5#2.19)
NetIC3_8: nRF24L01 (IC3.8), STM32F103CBT6 (U5#2.2)
NetQ1_1: Motor (Q1.1 R13.2), STM32F103CBT6 (U5#2.10)
NetQ2_1: Motor (Q2.1 R14.2), STM32F103CBT6 (U5#2.11)
NetQ3_1: Motor (Q3.1 R15.2), STM32F103CBT6 (U5#2.12)
NetQ4_1: Motor (Q4.1 R16.2), STM32F103CBT6 (U5#2.13)
NetR3#2_1: WiFi (R3#2.1), STM32F103CBT6 (U5#2.46)
NetR6#1_2: BlueTooth (R6#1.2), STM32F103CBT6 (U5#2.45)
NetR9#2_1: Motor (R9#2.1), STM32F103CBT6 (U5#2.25)
NetR10_1: Motor (R10.1), STM32F103CBT6 (U5#2.26)
NetR11_1: Motor (R11.1), STM32F103CBT6 (U5#2.27)
NetR12_1: Motor (R12.1), STM32F103CBT6 (U5#2.28)
NetR17_1: MPU (R17.1 U1#2.24), STM32F103CBT6 (U5#2.43)
NetR18_1: MPU (R18.1 U1#2.23), STM32F103CBT6 (U5#2.42)
NetU1#2_12: MPU (U1#2.12), STM32F103CBT6 (U5#2.3)
NetU2#2_15: MPU (U2#2.15), STM32F103CBT6 (U5#2.4)